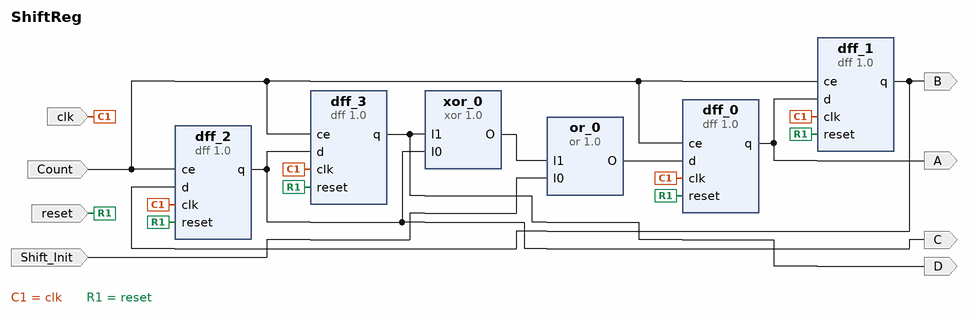
[diagram p0: block diagram of the top level]
# Vivado block design ShiftReg, xc7a35tcpg236-1, Vivado 2018.3
create_bd_design ShiftReg

create_bd_port -dir I -type data Shift_Init
create_bd_port -dir I clk
create_bd_port -dir I Count
create_bd_port -dir I reset
create_bd_port -dir O -type data A
create_bd_port -dir O -type data B
create_bd_port -dir O -type data C
create_bd_port -dir O -type data D

create_bd_cell -type ip -vlnv FIT:user:or:1.0 or_0
create_bd_cell -type ip -vlnv FIT:user:dff:1.0 dff_0
set_property -dict {CONFIG.CE true} [get_bd_cells dff_0]
create_bd_cell -type ip -vlnv FIT:user:dff:1.0 dff_1
set_property -dict {CONFIG.CE true} [get_bd_cells dff_1]
create_bd_cell -type ip -vlnv FIT:user:dff:1.0 dff_2
set_property -dict {CONFIG.CE true} [get_bd_cells dff_2]
create_bd_cell -type ip -vlnv FIT:user:dff:1.0 dff_3
set_property -dict {CONFIG.CE true} [get_bd_cells dff_3]
create_bd_cell -type ip -vlnv FIT:user:xor:1.0 xor_0

# ---- connections ----

connect_bd_net -net I0_0_1 [get_bd_ports Shift_Init] [get_bd_pins or_0/I0]
connect_bd_net [get_bd_pins or_0/O] [get_bd_pins dff_0/d]
connect_bd_net -net clk_0_1 [get_bd_ports clk] [get_bd_pins dff_0/clk] [get_bd_pins dff_1/clk] [get_bd_pins dff_2/clk] [get_bd_pins dff_3/clk]
connect_bd_net -net ce_0_1 [get_bd_ports Count] [get_bd_pins dff_0/ce] [get_bd_pins dff_1/ce] [get_bd_pins dff_2/ce] [get_bd_pins dff_3/ce]
connect_bd_net -net reset_0_1 [get_bd_ports reset] \
  [get_bd_pins dff_0/reset] [get_bd_pins dff_1/reset] [get_bd_pins dff_2/reset] [get_bd_pins dff_3/reset]
connect_bd_net [get_bd_pins dff_0/q] [get_bd_ports A] [get_bd_pins dff_1/d]
connect_bd_net [get_bd_pins dff_1/q] [get_bd_ports B] [get_bd_pins dff_2/d]
connect_bd_net [get_bd_pins xor_0/O] [get_bd_pins or_0/I1]
connect_bd_net [get_bd_pins dff_2/q] [get_bd_pins dff_3/d] [get_bd_ports C] [get_bd_pins xor_0/I0]
connect_bd_net [get_bd_pins dff_3/q] [get_bd_ports D] [get_bd_pins xor_0/I1]

validate_bd_design
save_bd_design
